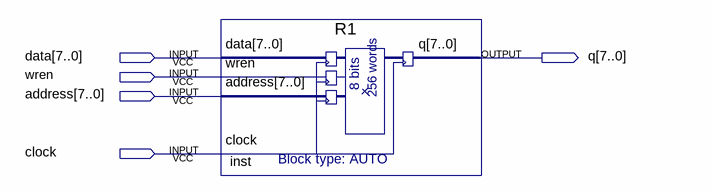
[diagram p0: schematic sheet]
// Quartus schematic RAM.bdf as structural Verilog: 1 symbols, 5 pins
module RAM (
  input  [7:0] data,
  input  wren,
  input  [7:0] address,
  input  clock,
  output [7:0] q
);

  R1 inst (.data(data), .wren(wren), .address(address), .clock(clock), .q(q));
endmodule
